# EasyEDA Pro project ProProject_485接口闭环步进电机控制器_V11_2025-04-04.epro, schematic Schematic1
Create Date: 2025-03-06; Page Name: P1; Project Name: 485接口闭环步进电机控制器_V11; Schematic Name: Schematic1; Update Date: 2025-03-23; Company: 嘉立创EDA; Page Size: A3; Version: V1.0
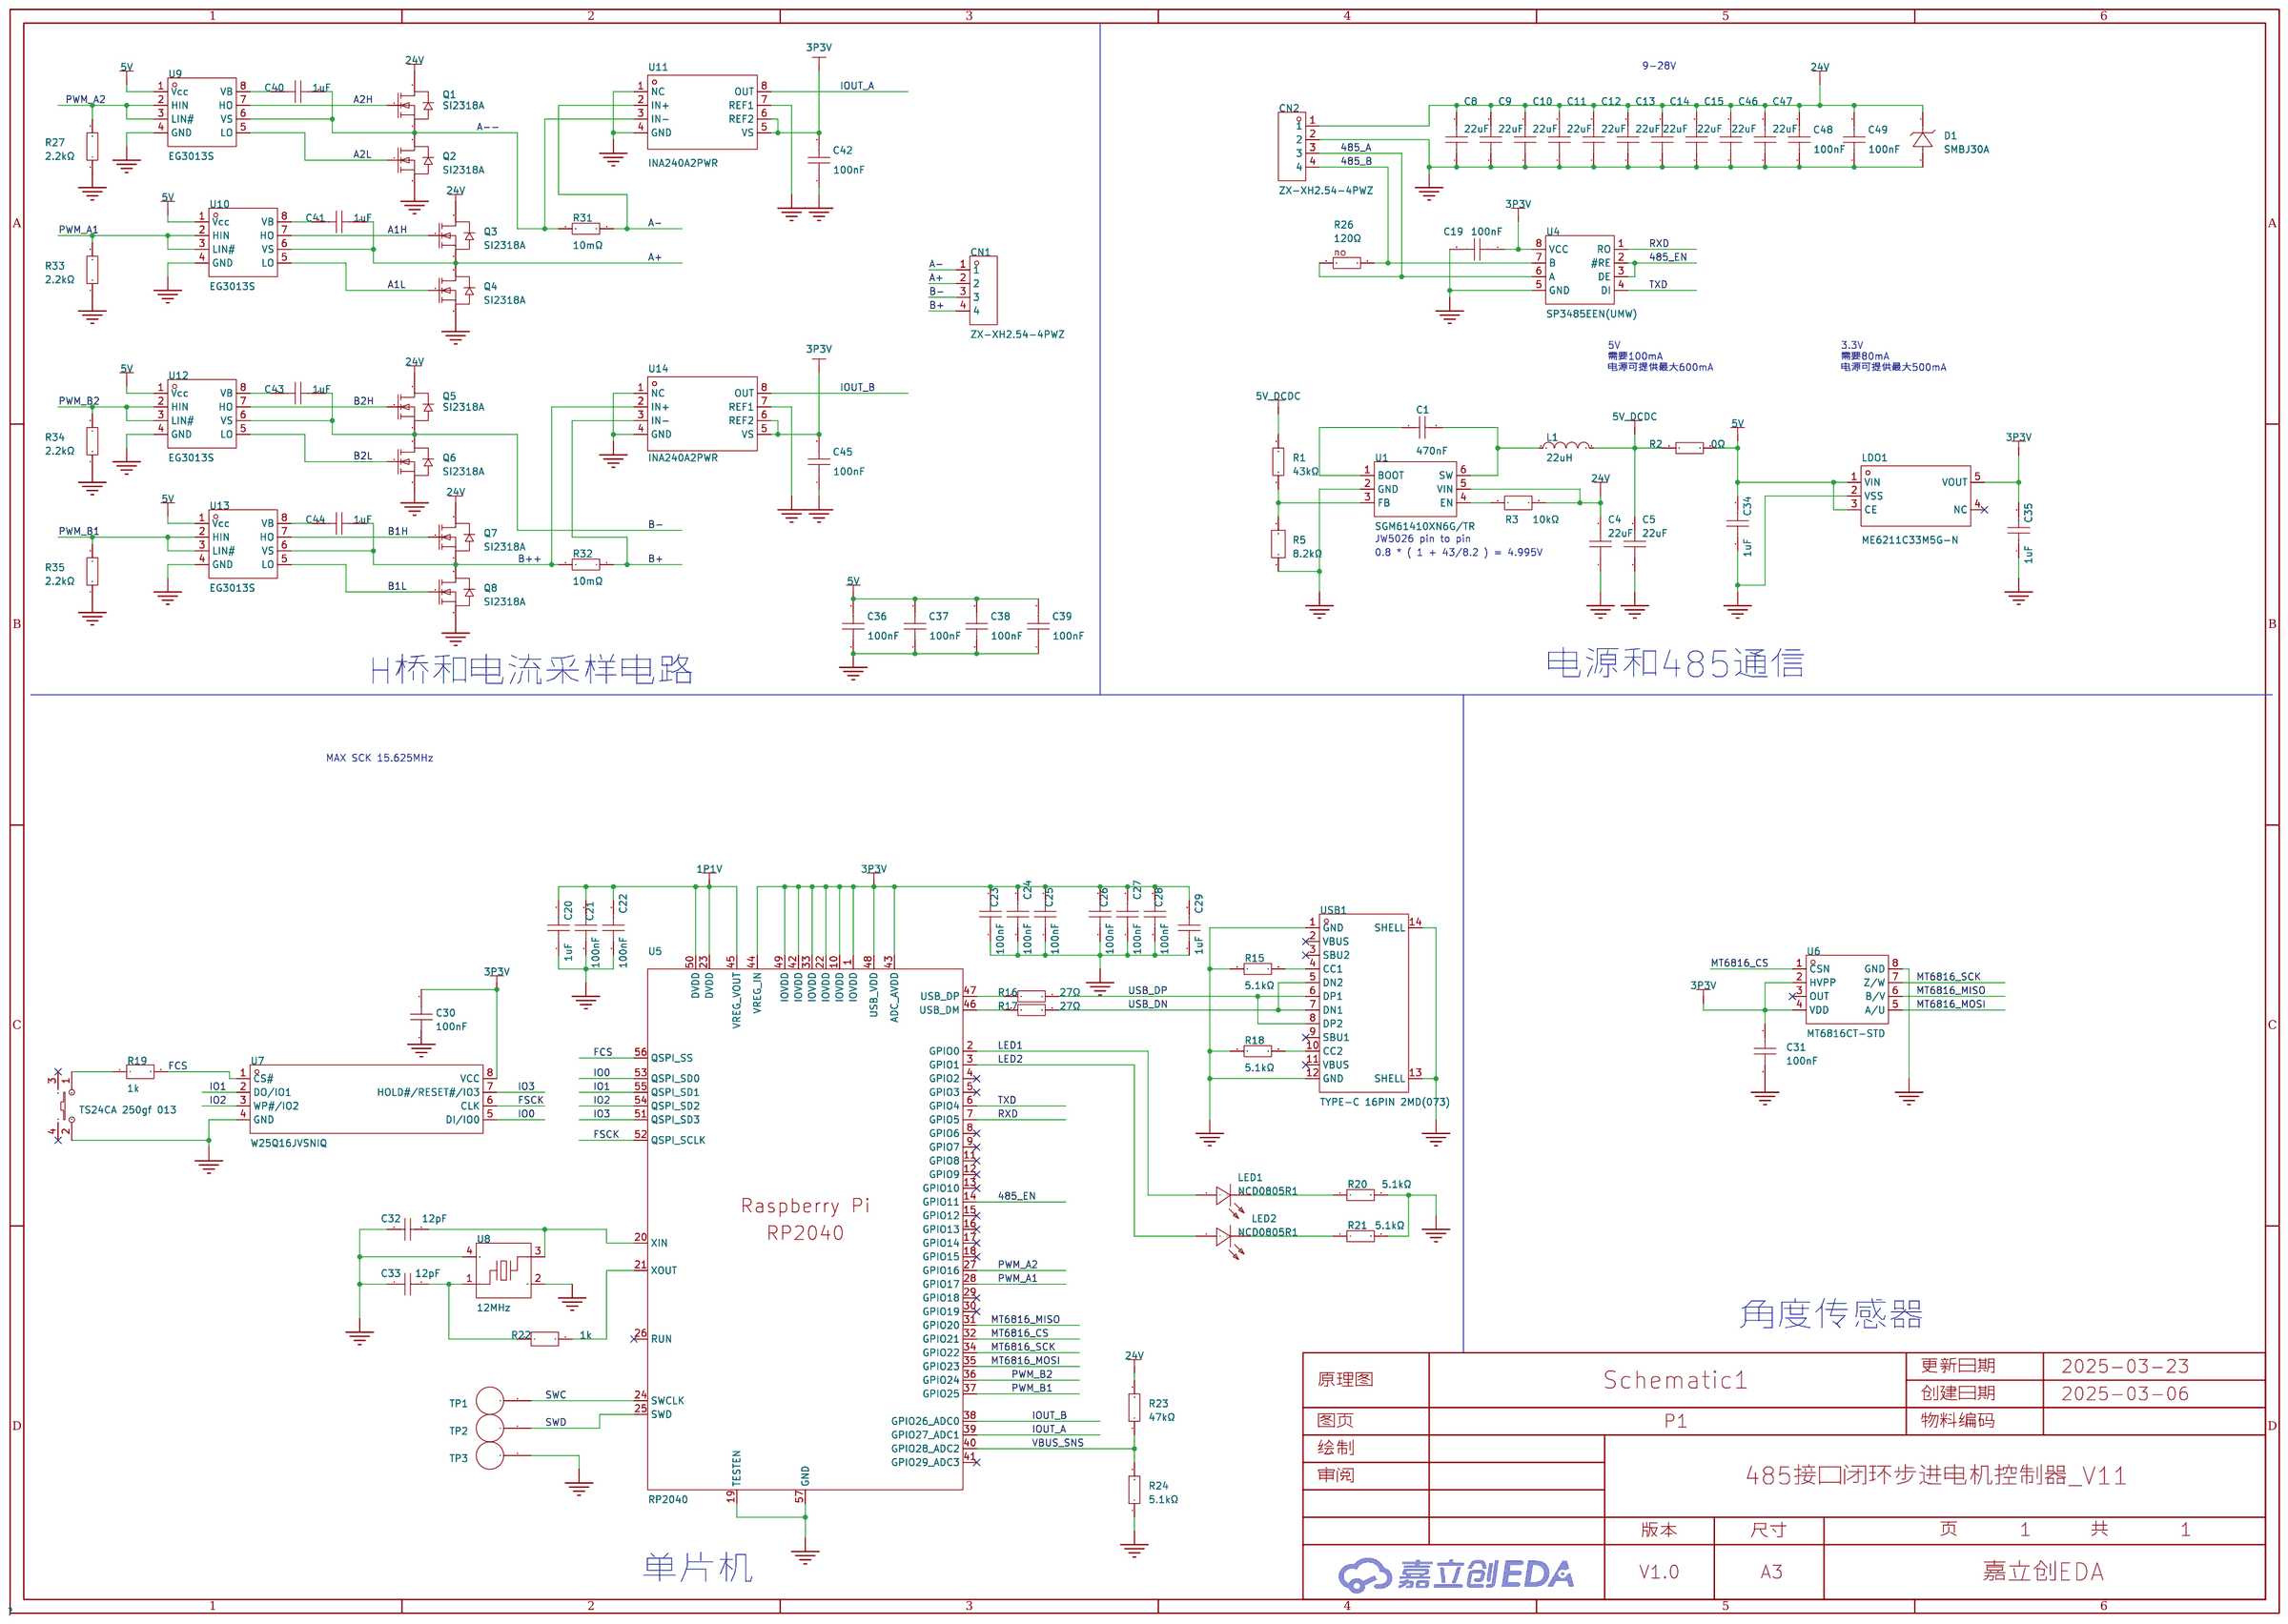
[diagram p0: schematic sheet]

## Parts
C1  470nF  [C0603]
C4  22uF  [C0805]
C5  22uF  [C0805]
C8  22uF  [C0805]
C9  22uF  [C0805]
C10  22uF  [C0805]
C11  22uF  [C0805]
C12  22uF  [C0805]
C13  22uF  [C0805]
C14  22uF  [C0805]
C15  22uF  [C0805]
C19  100nF  [C0603]
C20  1uF  [C0603]
C21  100nF  [C0603]
C22  100nF  [C0603]
C23  100nF  [C0603]
C24  100nF  [C0603]
C25  100nF  [C0603]
C26  100nF  [C0603]
C27  100nF  [C0603]
C28  100nF  [C0603]
C29  1uF  [C0603]
C30  100nF  [C0603]
C31  100nF  [C0603]
C32  12pF  [C0603]
C33  12pF  [C0603]
C34  1uF  [C0603]
C35  1uF  [C0603]
C36  100nF  [C0603]
C37  100nF  [C0603]
C38  100nF  [C0603]
C39  100nF  [C0603]
C40  1uF  [C0603]
C41  1uF  [C0603]
C42  100nF  [C0603]
C43  1uF  [C0603]
C44  1uF  [C0603]
C45  100nF  [C0603]
C46  22uF  [C0805]
C47  22uF  [C0805]
C48  100nF  [C0603]
C49  100nF  [C0603]
CN1  ZX-XH2.54-4PWZ  [CONN-TH_4P-P2.50_ZX-XH2.54-4PWZ]
CN2  ZX-XH2.54-4PWZ  [CONN-TH_4P-P2.50_ZX-XH2.54-4PWZ]
D1  SMBJ30A  [SMB_L4.6-W3.6-LS5.4-RD]
L1  22uH  [IND-SMD_L4.0-W4.0]
LDO1  ME6211C33M5G-N  [SOT-23-5_L3.0-W1.7-P0.95-LS2.8-BL]
LED1  NCD0805R1  [LED0805-R-RD]
LED2  NCD0805R1  [LED0805-R-RD]
Q1  SI2318A  [SOT-23-3_L2.9-W1.3-P1.90-LS2.4-BR]
Q2  SI2318A  [SOT-23-3_L2.9-W1.3-P1.90-LS2.4-BR]
Q3  SI2318A  [SOT-23-3_L2.9-W1.3-P1.90-LS2.4-BR]
Q4  SI2318A  [SOT-23-3_L2.9-W1.3-P1.90-LS2.4-BR]
Q5  SI2318A  [SOT-23-3_L2.9-W1.3-P1.90-LS2.4-BR]
Q6  SI2318A  [SOT-23-3_L2.9-W1.3-P1.90-LS2.4-BR]
Q7  SI2318A  [SOT-23-3_L2.9-W1.3-P1.90-LS2.4-BR]
Q8  SI2318A  [SOT-23-3_L2.9-W1.3-P1.90-LS2.4-BR]
R1  43kΩ  [R0603]
R2  0Ω  [R0603]
R3  10kΩ  [R0603]
R5  8.2kΩ  [R0603]
R15  5.1kΩ  [R0603]
R16  27Ω  [R0603]
R17  27Ω  [R0603]
R18  5.1kΩ  [R0603]
R19  1k  [R0603]
R20  5.1kΩ  [R0603]
R21  5.1kΩ  [R0603]
R22  1k  [R0603]
R23  47kΩ  [R0603]
R24  5.1kΩ  [R0603]
R26  120Ω  [R0603]  (no BOM)
R27  2.2kΩ  [R0603]
R31  10mΩ  [R0805]
R32  10mΩ  [R0805]
R33  2.2kΩ  [R0603]
R34  2.2kΩ  [R0603]
R35  2.2kΩ  [R0603]
SW1  TS24CA 250gf 013  [SW-SMD_L4.7-W3.5-P3.35-EH]
TP1  -  [TP]  (no BOM)
TP2  -  [TP]  (no BOM)
TP3  -  [TP]  (no BOM)
U1  SGM61410XN6G/TR  [TSOT-23-6_L2.9-W1.6-P0.95-LS2.8-BL]
U4  SP3485EEN(UMW)  [SOP-8_L5.0-W4.0-P1.27-LS6.0-BL]
U5  RP2040  [LQFN-56_L7.0-W7.0-P0.4-EP]
U6  MT6816CT-STD  [SOP-8_L4.9-W3.9-P1.27-LS6.0-BL]
U7  W25Q16JVSNIQ  [SOP-8_L4.9-W3.9-P1.27-LS6.0-BL]
U8  12MHz  [CRYSTAL-SMD_4P-L3.2-W2.5-BL_SIT8008BI]
U9  EG3013S  [SOP-8_L4.9-W3.9-P1.27-LS6.0-BL-1]
U10  EG3013S  [SOP-8_L4.9-W3.9-P1.27-LS6.0-BL-1]
U11  INA240A2PWR  [TSSOP-8_L4.4-W3.0-P0.65-LS6.4-BL]
U12  EG3013S  [SOP-8_L4.9-W3.9-P1.27-LS6.0-BL-1]
U13  EG3013S  [SOP-8_L4.9-W3.9-P1.27-LS6.0-BL-1]
U14  INA240A2PWR  [TSSOP-8_L4.4-W3.0-P0.65-LS6.4-BL]
USB1  TYPE-C 16PIN 2MD(073)  [USB-C-SMD_TYPE-C-6PIN-2MD-073]

## Library data of the parts
C1 = CL10B474KA8NNNC: 容值:470nF;精度:±10%;额定电压:25V;材质(温度系数):X7R;; LCSC Part Name: 470nF ±10% 25V; Supplier Part: C1623; Manufacturer: SAMSUNG(三星); Supplier Footprint: 0603; JLCPCB Part Class: 基础库; Datasheet: https://atta.szlcsc.com/upload/public/pdf/source/20160218/1457707763339.pdf; Supplier: LCSC; Tolerance: ±10%; Voltage Rated: 25V; Temperature Coefficient: X7R
C4 C5 C8-C15 C46 C47 = CGA0805X5R226M350MT: 容值:22uF;精度:±20%;额定电压:35V;材质(温度系数):X5R;; LCSC Part Name: 22uF ±20% 35V; Supplier Part: C6119901; Manufacturer: HRE(芯声); Supplier Footprint: 0805; JLCPCB Part Class: 扩展库; Datasheet: https://atta.szlcsc.com/upload/public/pdf/source/20231129/D589D0CC4D260F7AC3A77E53B455CCB3.pdf; Supplier: LCSC; Tolerance: ±20%; Voltage Rated: 35V; Temperature Coefficient: X5R
C19 C21-C28 C30 C31 C36-C39 C42 C45 C48 C49 = CC0603KRX7R9BB104: 容值:100nF;精度:±10%;额定电压:50V;材质(温度系数):X7R;; LCSC Part Name: 100nF ±10% 50V; Supplier Part: C14663; Manufacturer: YAGEO(国巨); Supplier Footprint: 0603; Datasheet: https://atta.szlcsc.com/upload/public/pdf/source/20180910/C282072_33301C7F631E79921B82A8DAC6BCC5B3.pdf; Supplier: LCSC; Tolerance: ±10%; Voltage Rated: 50V; Temperature Coefficient: X7R
C20 C29 C34 C35 C40 C41 C43 C44 = CL10A105KB8NNNC: 容值:1uF;精度:±10%;额定电压:50V;材质(温度系数):X5R;; LCSC Part Name: 1uF ±10% 50V; Supplier Part: C15849; Manufacturer: SAMSUNG(三星); Supplier Footprint: 0603; Datasheet: https://atta.szlcsc.com/upload/public/pdf/source/20160218/1457707763339.pdf; Supplier: LCSC; Tolerance: ±10%; Voltage Rated: 50V; Temperature Coefficient: X5R
C32 C33 = CL10C120JB8NNNC: 容值:12pF;精度:±5%;额定电压:50V;材质(温度系数):C0G;; LCSC Part Name: 12pF ±5% 50V; Supplier Part: C38523; Manufacturer: SAMSUNG(三星); Supplier Footprint: 0603; JLCPCB Part Class: 基础库; Datasheet: https://atta.szlcsc.com/upload/public/pdf/source/20160218/1457707763339.pdf; Supplier: LCSC; Tolerance: ±5%; Voltage Rated: 50V; Temperature Coefficient: C0G
CN1 CN2 = ZX-XH2.54-4PWZ: 插针结构:1x4P;间距:2.5mm;安装方式:弯插;参考系列:XH;总PIN数:4P;排数:1;每排PIN数:4;行距:-;额定电流:3A;触头材质:黄铜;触头镀层:锡;工作温度范围:-25℃~+85℃;; LCSC Part Name: 1x4P 间距:2.5mm 弯插 系列:XH; Supplier Part: C7429643; Manufacturer: Megastar(兆星); Supplier Footprint: 弯插,P=2.5mm; JLCPCB Part Class: 扩展库; Datasheet: https://atta.szlcsc.com/upload/public/pdf/source/20230619/8DC602C7BA46C153FF1BE89D90453879.pdf; Supplier: LCSC; Pins Structure: 1x4P; Pitch: 2.5mm; Mounting Type: 弯插; Reference Series: XH; Number of Pins: 4P; Number of Rows: 1; Number of PINs Per Row: 4; Rated Current: 3A; Contact Material: 黄铜; Contact Plating: 锡; Operating Temperature: -25℃~+85℃; Rated Voltage (Max): 250V; Plastic Material: PA66; Flame Retardant Rating: UL94V-0; Color: 白色; Z-Height of the Board: 5.9mm; X-Length of Bottom Edge on Board (Spacing Line): 12.5mm; Y-Width of Bottom Edge on Board: 7.32mm
D1 = SMBJ30A_C19077584: 极性:单向;反向截止电压(Vrwm):30V;钳位电压:48.4V;峰值脉冲电流(Ipp):12.4A;峰值脉冲功率(Ppp):600W;击穿电压:33.3V;; Supplier Part: C19077584; Manufacturer: 宏嘉诚; Supplier Footprint: SMB; JLCPCB Part Class: Extended Part; Datasheet: https://atta.szlcsc.com/upload/public/pdf/source/20250107/474F05451FC8AB27D7FA0238914F96F6.pdf; Supplier: LCSC; Polarity: 单向; Reverse Stand-Off Voltage (Vrwm): 30V; Clamping Voltage: 48.4V; Peak Pulse Current (Ipp): 12.4A; Peak Pulse Power Dissipation (Ppp): 600W; Voltage - Breakdown: 33.3V; Reverse Leakage Current (Ir): 5uA; Number of Channels: 单路; Type: TVS
L1 = FHD4020S-220MT: 电感值:22uH;精度:±20%;额定电流:1.1A;饱和电流(Isat):1.5A;; LCSC Part Name: 22uH ±20% 1.5A; Supplier Part: C843299; Manufacturer: cjiang(长江微电); Supplier Footprint: SMD,4x4mm; JLCPCB Part Class: 扩展库; Datasheet: https://atta.szlcsc.com/upload/public/pdf/source/20200609/C601990_BCEA243EC4DA0A9A288AA78A6DFB48A5.pdf; Supplier: LCSC; Tolerance: ±20%; Rated Current: 1.1A; Saturation Current (Isat): 1.5A; DC Resistance (DCR): 415mΩ
LDO1 = ME6211C33M5G-N: 输出类型:固定;最大输入电压:6V;输出电压:3.3V;最大输出电流:500mA;电源纹波抑制比(PSRR):70dB;输出极性:正极;; LCSC Part Name: 输入6V 输出3.3V 500mA; Supplier Part: C82942; Manufacturer: MICRONE(南京微盟); Supplier Footprint: SOT-23-5; JLCPCB Part Class: 扩展库; Datasheet: https://atta.szlcsc.com/upload/public/pdf/source/20170918/C82942_1505727073070976520.pdf; Supplier: LCSC; Output Type: 固定; Maximum Input Voltage: 6V; Output Voltage: 3.3V; MAX Output Current: 500mA; Power Supply Rejection Ratio (PSRR): 70dB; Dropout Voltage: 260mV@(200mA); Output Polarity: 正极; Number of Outputs: 1
LED1 LED2 = NCD0805R1: 灯头类型:-;发光颜色:红色;正向电压(VF):1.6V~2.6V;功率:65mW;正向电流:20mA;主波长:615nm~630nm;二极管配置:独立二极管;透镜颜色:无色透明透镜;色温:-;发光强度:67mcd~195mcd;发光角度:130°;载带方式:-;工作温度:-30℃~+85℃;; Supplier Part: C84256; Manufacturer: 国星光电; Supplier Footprint: 0805; JLCPCB Part Class: 基础库; Datasheet: https://atta.szlcsc.com/upload/public/pdf/source/20200820/C84256_F0A75A43B3EAD75808600A0514C76B99.pdf; Supplier: LCSC; Emitted Color: 红色; Forward Voltage (VF): 1.6V~2.6V; Power Dissipation: 65mW; Forward Current: 20mA; Dominant Wavelength: 615nm~630nm; Diode Configuration: 独立二极管; Lens Color: 无色透明透镜; Luminous Intensity: 67mcd~195mcd; Viewing Angle: 130°; Operating Temperature: -30℃~+85℃
Q1-Q8 = SI2318A: 类型:1个N沟道;漏源电压(Vdss):40V;连续漏极电流(Id):5.6A;导通电阻(RDS(on)@Vgs,Id):46mΩ@4.5V,3.9A;功率(Pd):1.25W;阈值电压(Vgs(th)@Id):1.2V@250uA;; LCSC Part Name: 1个N沟道 耐压:40V 电流:5.6A; Supplier Part: C2681218; Manufacturer: UMW(友台半导体); Supplier Footprint: SOT-23; JLCPCB Part Class: Extended Part; Datasheet: https://atta.szlcsc.com/upload/public/pdf/source/20231109/51CF644F539AF1C6DDE945D9CE214444.pdf; Supplier: LCSC; Type: 1个N沟道; Drain Source Voltage (Vdss): 40V; Continuous Drain Current (Id): 5.6A; Drain Source On Resistance (RDS(on)@Vgs,Id): 46mΩ@4.5V,3.9A; Power Dissipation (Pd): 1.25W; Gate Threshold Voltage (Vgs(th)@Id): 1.2V@250uA; Total Gate Charge (Qg@Vgs): 5.8nC@20V; Input Capacitance (Ciss@Vds): 340pF; Reverse Transfer Capacitance (Crss@Vds): 30pF; Operating Temperature: -55℃~+150℃
R1 = 0603WAF4302T5E: 电阻类型:厚膜电阻;阻值:43kΩ;精度:±1%;功率:100mW;最大工作电压:75V;温度系数:±100ppm/℃;; LCSC Part Name: 43kΩ ±1% 100mW 厚膜电阻; Supplier Part: C23172; Manufacturer: UNI-ROYAL(厚声); Supplier Footprint: 0603; JLCPCB Part Class: Extended Part; Datasheet: https://atta.szlcsc.com/upload/public/pdf/source/20200306/C422600_1E6D84923E4A46A82E41ADD87F860B5C.pdf; Supplier: LCSC; Type: 厚膜电阻; Tolerance: ±1%; Power(Watts): 100mW; Overload Voltage (Max): 75V; Temperature Coefficient: ±100ppm/℃; Operating Temperature Range: -55℃~+155℃
R2 = 0603WAF0000T5E: 电阻类型:厚膜电阻;阻值:0Ω;精度:±1%;功率:100mW;最大工作电压:75V;; LCSC Part Name: 0Ω ±1% 100mW 厚膜电阻; Supplier Part: C21189; Manufacturer: UNI-ROYAL(厚声); Supplier Footprint: 0603; JLCPCB Part Class: 基础库; Datasheet: https://atta.szlcsc.com/upload/public/pdf/source/20200306/C422600_1E6D84923E4A46A82E41ADD87F860B5C.pdf; Supplier: LCSC; Type: 厚膜电阻; Tolerance: ±1%; Power(Watts): 100mW; Overload Voltage (Max): 75V; Operating Temperature Range: -55℃~+155℃
R3 = AT0603BRD0710KL: 电阻类型:薄膜电阻;阻值:10kΩ;精度:±0.1%;功率:100mW;; LCSC Part Name: 10kΩ ±0.1% 100mW; Supplier Part: C723396; Manufacturer: YAGEO(国巨); Supplier Footprint: 0603; JLCPCB Part Class: 扩展库; Datasheet: https://atta.szlcsc.com/upload/public/pdf/source/20200722/C705051_EA338A836C78FCD1C867566BE6F43B3A.pdf; Supplier: LCSC; Type: 薄膜电阻; Tolerance: ±0.1%; Power(Watts): 100mW; Temperature Coefficient: ±25ppm/℃; Overload Voltage (Max): 75V; Operating Temperature Range: -55℃~+155℃
R5 = FRC0603F8201TS: 电阻类型:厚膜电阻;阻值:8.2kΩ;精度:±1%;功率:100mW;工作电压:75V;温度系数:±100ppm/℃;; LCSC Part Name: 8.2kΩ ±1% 100mW 厚膜电阻; Supplier Part: C2907069; Manufacturer: FOJAN(富捷); Supplier Footprint: 0603; JLCPCB Part Class: Extended Part; Datasheet: https://atta.szlcsc.com/upload/public/pdf/source/20211221/925EC7D7225764EE0046F22065062C87.pdf; Supplier: LCSC; Type: 厚膜电阻; Tolerance: ±1%; Power(Watts): 100mW; Voltage-Supply(Max): 75V; Temperature Coefficient: ±100ppm/℃; Operating Temperature: -55℃~+155℃; Overload Voltage (Max): 75V; Operating Temperature Range: -55℃~+155℃
R15 R18 R20 R21 R24 = 0603WAF5101T5E: 阻值:5.1kΩ;精度:±1%;功率:100mW;温度系数:±100ppm/℃;电阻类型:厚膜电阻;; LCSC Part Name: 5.1kΩ ±1% 100mW 厚膜电阻; Supplier Part: C23186; Manufacturer: UNI-ROYAL(厚声); Supplier Footprint: 0603; Datasheet: https://atta.szlcsc.com/upload/public/pdf/source/20200306/C422600_1E6D84923E4A46A82E41ADD87F860B5C.pdf; Supplier: LCSC; Tolerance: ±1%; Power(Watts): 100mW; Overload Voltage (Max): 75V; Temperature Coefficient: ±100ppm/℃; Type: 厚膜电阻; Operating Temperature Range: -55℃~+155℃
R16 R17 = RS-03K27R0FT: 精度:±1%;温度系数:±100ppm/℃;阻值:27Ω;功率:100mW;最大工作电压:50V;工作温度范围:-55℃~+155℃;; LCSC Part Name: 27.0Ω(27R0) ±1%; Supplier Part: C321830; Manufacturer: FH(风华); Supplier Footprint: 0603; JLCPCB Part Class: 扩展库; Datasheet: https://atta.szlcsc.com/upload/public/pdf/source/20181120/C321830_E77A57045CE9A79D257E73FE3C106617.pdf; Supplier: LCSC; Tolerance: ±1%; Temperature Coefficient: ±100ppm/℃; Power(Watts): 100mW; Overload Voltage (Max): 50V; Operating Temperature Range: -55℃~+155℃
R19 R22 = 1k: Supplier Part: C9900012840; JLCPCB Part Class: 扩展库; Supplier: LCSC
R23 = 0603WAF4702T5E: 电阻类型:厚膜电阻;阻值:47kΩ;精度:±1%;功率:100mW;最大工作电压:75V;温度系数:±100ppm/℃;; LCSC Part Name: 47kΩ ±1% 100mW 厚膜电阻; Supplier Part: C25819; Manufacturer: UNI-ROYAL(厚声); Supplier Footprint: 0603; JLCPCB Part Class: 基础库; Datasheet: https://atta.szlcsc.com/upload/public/pdf/source/20200306/C422600_1E6D84923E4A46A82E41ADD87F860B5C.pdf; Supplier: LCSC; Type: 厚膜电阻; Tolerance: ±1%; Power(Watts): 100mW; Overload Voltage (Max): 75V; Temperature Coefficient: ±100ppm/℃; Operating Temperature Range: -55℃~+155℃
R26 = 0603WAF1200T5E: 电阻类型:厚膜电阻;阻值:120Ω;精度:±1%;功率:100mW;最大工作电压:75V;温度系数:±100ppm/℃;; LCSC Part Name: 120Ω ±1% 100mW 厚膜电阻; Supplier Part: C22787; Manufacturer: UNI-ROYAL(厚声); Supplier Footprint: 0603; JLCPCB Part Class: 基础库; Datasheet: https://atta.szlcsc.com/upload/public/pdf/source/20200306/C422600_1E6D84923E4A46A82E41ADD87F860B5C.pdf; Supplier: LCSC; Type: 厚膜电阻; Tolerance: ±1%; Power(Watts): 100mW; Overload Voltage (Max): 75V; Temperature Coefficient: ±100ppm/℃; Operating Temperature Range: -55℃~+155℃
R27 R33-R35 = 0603WAF2201T5E: 电阻类型:厚膜电阻;阻值:2.2kΩ;精度:±1%;功率:100mW;最大工作电压:75V;温度系数:±100ppm/℃;; LCSC Part Name: 2.2kΩ ±1% 100mW 厚膜电阻; Supplier Part: C4190; Manufacturer: UNI-ROYAL(厚声); Supplier Footprint: 0603; JLCPCB Part Class: Basic Part; Datasheet: https://atta.szlcsc.com/upload/public/pdf/source/20200306/C422600_1E6D84923E4A46A82E41ADD87F860B5C.pdf; Supplier: LCSC; Type: 厚膜电阻; Tolerance: ±1%; Power(Watts): 100mW; Overload Voltage (Max): 75V; Temperature Coefficient: ±100ppm/℃; Operating Temperature Range: -55℃~+155℃
R31 R32 = 0805W4F100MT5E: 电阻类型:厚膜电阻;阻值:10mΩ;精度:±1%;功率:250mW;最大工作电压:150V;; LCSC Part Name: 10mΩ ±1% 250mW 厚膜电阻; Supplier Part: C270927; Manufacturer: UNI-ROYAL(厚声); Supplier Footprint: 0805; JLCPCB Part Class: Extended Part; Datasheet: https://atta.szlcsc.com/upload/public/pdf/source/20191226/C423819_BA9DD8C30400529167FBE977063CB830.pdf; Supplier: LCSC; Type: 厚膜电阻; Tolerance: ±1%; Power(Watts): 250mW; Overload Voltage (Max): 150V; Operating Temperature Range: -55℃~+155℃
SW1 = TS24CA 250gf 013: 电路结构:单刀单掷;按钮形状:矩形按钮;作用力:250gf;安装方式:卧贴;开关长度:4.55mm;开关宽度:1.8mm;开关高度:3.5mm;带支架:不带;触点电流:50mA;额定电压(AC):-;额定电压(DC):12V;额定功率:0.6W;绝缘电阻:100MΩ;带灯:无;机械寿命:3万次;; LCSC Part Name: 2*4*3.5mm半包小贝贝TS-018小侧按键m165蓝牙耳机开关 250gf; Supplier Part: C5373430; Manufacturer: SHOU HAN(首韩); Supplier Footprint: SMD; JLCPCB Part Class: 扩展库; Datasheet: https://atta.szlcsc.com/upload/public/pdf/source/20230321/913029B0FB0CD391AF5EFD51697D8EC4.pdf; Supplier: LCSC; Circuit: 单刀单掷; Actuator Style: 矩形按钮; Operating Force: 250gf; Mounting Style: 卧贴; Switch Length: 4.55mm; Switch Width: 1.8mm; Switch Height: 3.5mm; Strike Gundam: 不带; Contact Current: 50mA; Voltage Rating (DC): 12V; Power Rating: 0.6W; Insulation Resistance: 100MΩ; Actuator/Cap Color: 黑色; With Lamp: 无; Mechanical Life: 3万次; Operating Temperature: -40℃~+85℃
TP1-TP3 = TP: Check: true
U1 = SGM61410XN6G/TR: Supplier Part: C699689; Manufacturer: SGMICRO(圣邦微); Supplier Footprint: SOT-23-6; JLCPCB Part Class: 扩展库; Datasheet: https://atta.szlcsc.com/upload/public/pdf/source/20221031/3A734AD801C2757449C6479E72FDC49F.pdf; Supplier: LCSC
U4 = SP3485EEN(UMW): 类型:收发器;数据速率:12Mbps;; LCSC Part Name: SP3485E 3.3V电源，最多256个节点，12Mbps半双工，RS485/RS422收发器; Supplier Part: C668205; Manufacturer: UMW(友台半导体); Supplier Footprint: SOP-8; JLCPCB Part Class: 扩展库; Datasheet: https://atta.szlcsc.com/upload/public/pdf/source/20240223/FED69C9FF7082854C69A701499F648A3.pdf; Supplier: LCSC; Types: 收发器; Number of Driver: 1; Number of receiver: 1; Supply Voltage: 2.97V~3.63V; Data Rate: 12Mbps; Operating Temperature: -40℃~+85℃
U5 = RP2040_C2040: CPU内核:ARM-M系列;CPU最大主频:133MHz;程序存储容量:-;程序存储器类型:-;GPIO端口数量:30;工作电压范围:-;RAM总容量:264KB;应用领域:-;; Supplier Part: C2040; Manufacturer: Raspberry Pi(树莓派); Supplier Footprint: LQFN-56(7x7); Datasheet: https://atta.szlcsc.com/upload/public/pdf/source/20210621/C2040_96F425825606B7957D87DD32E2512CA9.pdf; Supplier: LCSC; CPU Core: ARM-M系列; CPU Maximum Speed: 133MHz; GPIO Ports Number: 30; RAM Size: 264KB; ADC (Bit): 12bit; UART/USART: 2; I2C: 2; SPI: 2; Universal Serial Bus: 有; Peripheral/Function: DMA；PWM; Direct Memory Access: 有
U6 = MT6816CT-STD: 零延迟磁角位置传感器IC; LCSC Part Name: 磁位置传感器; Supplier Part: C2925077; Manufacturer: MagnTek(麦歌恩); Supplier Footprint: SOP-8; JLCPCB Part Class: 扩展库; Datasheet: https://atta.szlcsc.com/upload/public/pdf/source/20211202/34073ED58EE6E476BE477C7F05608C83.pdf; Supplier: LCSC
U7 = W25Q16JVSNIQ_C2456211: Supplier Part: C2456211; Manufacturer: WINBOND(华邦); Supplier Footprint: SOP-8; JLCPCB Part Class: 扩展库; Datasheet: https://atta.szlcsc.com/upload/public/pdf/source/20190529/C115407_78E5B4F96E7138D299EC51EC5982A1A5.pdf; Supplier: LCSC
U8 = CF4012M00012001: 晶振类型:贴片晶振;频率:12MHz;常温频差:±10ppm;外接负载电容:12pF;频率稳定度(全温):±30ppm;; LCSC Part Name: 12MHz ±10ppm 12pF; Supplier Part: C7294550; Manufacturer: HUAXIN(华昕); Supplier Footprint: SMD-3225-4P; Datasheet: https://atta.szlcsc.com/upload/public/pdf/source/20230614/3722586679DD390FF3DAA05DC65F5BC0.pdf; Supplier: LCSC; Crystal Type: 贴片晶振; Normal temperature Frequency Tolerance: ±10ppm; External load capacitor: 12pF; Frequency Stability(Full temperature range): ±30ppm; Equivalent Series Resistance (ESR): 40Ω; Operating Temperature: -40℃~+85℃
U9 U10 U12 U13 = EG3013S: Supplier Part: C5138297; Manufacturer: EG(屹晶微); Supplier Footprint: SOP-8; JLCPCB Part Class: Extended Part; Datasheet: https://atta.szlcsc.com/upload/public/pdf/source/20240401/B57332368F1567A90B75A8EC20454C1B.pdf; Supplier: LCSC
U11 U14 = INA240A2PWR: 放大器数:单路;; Supplier Part: C129949; Manufacturer: TI(德州仪器); Supplier Footprint: TSSOP-8; JLCPCB Part Class: Extended Part; Datasheet: https://www.ti.com/cn/lit/gpn/ina240; Supplier: LCSC; Number of Channels: 单路; Supply Current: 1.8mA; Operating Temperature: -40℃~+125℃
USB1 = TYPE-C 16PIN 2MD(073): 连接器类型:Type-C;标准:-;公母:母;触点数量:16P;端口数量:1;安装方式:卧贴;额定电流 - 电源:5A;工作温度范围:-25℃~+85℃;; LCSC Part Name: Type-C 母 卧贴 带定位柱 不锈钢外壳 2次模顶; Supplier Part: C2765186; Manufacturer: SHOU HAN(首韩); Supplier Footprint: SMD; JLCPCB Part Class: 扩展库; Datasheet: https://atta.szlcsc.com/upload/public/pdf/source/20211123/39B17C16241EAC15C5E277BDA434118E.pdf; Supplier: LCSC; Connector Type: Type-C; Gender: 母; Number of Contacts: 16P; Number of Ports: 1; Mounting Style: 卧贴; Current Rating - Power (Max): 5A; Operating Temperature Range: -25℃~+85℃

## Nets
5V: C34.2 C36.2 C37.2 C38.2 C39.2 LDO1.1(VIN) LDO1.3(CE) R2.2 U9.1(Vcc) U10.1(Vcc) U12.1(Vcc) U13.1(Vcc)
5V_DCDC: C5.2 L1.2 R1.2 R2.1
24V: C4.2 C8.2 C9.2 C10.2 C11.2 C12.2 C13.2 C14.2 C15.2 C46.2 C47.2 C48.2 C49.2 CN2.1 D1.1(K) Q1.3(D) Q3.3(D) Q5.3(D) Q7.3(D) R3.2 R23.2 U1.5(VIN)
GND: C4.1 C5.1 C8.1 C9.1 C10.1 C11.1 C12.1 C13.1 C14.1 C15.1 C19.2 C20.1 C21.1 C22.1 C23.1 C24.1 C25.1 C26.1 C27.1 C28.1 C29.1 C30.1 C31.2 C32.1 C33.1 C34.1 C35.1 C36.1 C37.1 C38.1 C39.1 C42.1 C45.1 C46.1 C47.1 C48.1 C49.1 CN2.2 D1.2(A) LDO1.2(VSS) Q2.2(S) Q4.2(S) Q6.2(S) Q8.2(S) R5.1 R15.1 R18.1 R20.2 R21.2 R24.1 R27.1 R33.1 R34.1 R35.1 SW1.2 TP3.1 U1.2(GND) U4.5(GND) U5.19(TESTEN) U5.57(GND) U6.8(GND) U7.4(GND) U8.2(GND) U8.4(GND) U9.4(GND) U10.4(GND) U11.1(NC) U11.4(GND) U11.7(REF1) U12.4(GND) U13.4(GND) U14.1(NC) U14.4(GND) U14.7(REF1) USB1.1(GND) USB1.12(GND) USB1.13(SHELL) USB1.14(SHELL)
VBUS_SNS: R23.1 R24.2 U5.40(GPIO28_ADC2)
1P1V: C20.2 C21.2 C22.2 U5.23(DVDD) U5.45(VREG_VOUT) U5.50(DVDD)
3P3V: C19.1 C23.2 C24.2 C25.2 C26.2 C27.2 C28.2 C29.2 C30.2 C31.1 C35.2 C42.2 C45.2 LDO1.5(VOUT) U4.8(VCC) U5.1(IOVDD) U5.10(IOVDD) U5.22(IOVDD) U5.33(IOVDD) U5.42(IOVDD) U5.43(ADC_AVDD) U5.44(VREG_IN) U5.48(USB_VDD) U5.49(IOVDD) U6.2(HVPP) U6.4(VDD) U7.8(VCC) U11.5(VS) U11.6(REF2) U14.5(VS) U14.6(REF2)
485_A: CN2.3 R26.1 U4.6(A)
485_B: CN2.4 R26.2 U4.7(B)
485_EN: U4.2(#RE) U4.3(DE) U5.14(GPIO11)
A1H: Q3.1(G) U10.7(HO)
A1L: Q4.1(G) U10.5(LO)
A2H: Q1.1(G) U9.7(HO)
A2L: Q2.1(G) U9.5(LO)
A+: C41.1 CN1.2 Q3.2(S) Q4.3(D) U10.6(VS)
A-: CN1.1 R31.2 U11.2(IN+)
A--: C40.1 Q1.2(S) Q2.3(D) R31.1 U9.6(VS) U11.3(IN-)
B1H: Q7.1(G) U13.7(HO)
B1L: Q8.1(G) U13.5(LO)
B2H: Q5.1(G) U12.7(HO)
B2L: Q6.1(G) U12.5(LO)
B+: CN1.4 R32.2 U14.3(IN-)
B++: C44.1 Q7.2(S) Q8.3(D) R32.1 U13.6(VS) U14.2(IN+)
B-: C43.1 CN1.3 Q5.2(S) Q6.3(D) U12.6(VS)
FCS: R19.2 U5.56(QSPI_SS) U7.1(CS#)
FSCK: U5.52(QSPI_SCLK) U7.6(CLK)
IO0: U5.53(QSPI_SD0) U7.5(DI/IO0)
IO1: U5.55(QSPI_SD1) U7.2(DO/IO1)
IO2: U5.54(QSPI_SD2) U7.3(WP#/IO2)
IO3: U5.51(QSPI_SD3) U7.7(HOLD#/RESET#/IO3)
IOUT_A: U5.39(GPIO27_ADC1) U11.8(OUT)
IOUT_B: U5.38(GPIO26_ADC0) U14.8(OUT)
LED1: LED1.1(+) U5.2(GPIO0)
LED2: LED2.1(+) U5.3(GPIO1)
MT6816_CS: U5.32(GPIO21) U6.1(CSN)
MT6816_MISO: U5.31(GPIO20) U6.6(B/V)
MT6816_MOSI: U5.35(GPIO23) U6.5(A/U)
MT6816_SCK: U5.34(GPIO22) U6.7(Z/W)
PWM_A1: R33.2 U5.28(GPIO17) U10.2(HIN) U10.3(LIN#)
PWM_A2: R27.2 U5.27(GPIO16) U9.2(HIN) U9.3(LIN#)
PWM_B1: R35.2 U5.37(GPIO25) U13.2(HIN) U13.3(LIN#)
PWM_B2: R34.2 U5.36(GPIO24) U12.2(HIN) U12.3(LIN#)
RXD: U4.1(RO) U5.7(GPIO5)
SWC: TP1.1 U5.24(SWCLK)
SWD: TP2.1 U5.25(SWD)
TXD: U4.4(DI) U5.6(GPIO4)
USB_DN: R17.2 USB1.5(DN2) USB1.7(DN1)
USB_DP: R16.2 USB1.6(DP1) USB1.8(DP2)
$1N1406: R18.2 USB1.10(CC2)
$1N1407: R15.2 USB1.4(CC1)
$1N1433: R19.1 SW1.1
$1N1437: R16.1 U5.47(USB_DP)
$1N1440: R17.1 U5.46(USB_DM)
$1N1441: R22.2 U5.21(XOUT)
$1N1445: C33.2 R22.1 U8.1
$1N1446: C32.2 U5.20(XIN) U8.3
$1N3757: R3.1 U1.4(EN)
$1N3760: C1.2 L1.1 U1.6(SW)
$1N3761: C1.1 U1.1(BOOT)
$1N3763: R1.1 R5.2 U1.3(FB)
$1N15393: LED1.2(-) R20.1
$1N15394: LED2.2(-) R21.1
$1N23169: C40.2 U9.8(VB)
$1N23635: C41.2 U10.8(VB)
$1N25067: C43.2 U12.8(VB)
$1N25091: C44.2 U13.8(VB)

Not connected (* = marked no-connect by the designer): LDO1 4(NC)*; SW1 3* 4*; U5 4(GPIO2)* 5(GPIO3)* 8(GPIO6)* 9(GPIO7)* 11(GPIO8)* 12(GPIO9)* 13(GPIO10)* 15(GPIO12)* 16(GPIO13)* 17(GPIO14)* 18(GPIO15)* 26(RUN)* 29(GPIO18)* 30(GPIO19)* 41(GPIO29_ADC3)*; U6 3(OUT)*; USB1 2(VBUS)* 3(SBU2)* 9(SBU1)* 11(VBUS)*

## Notes on the sheet
- 9-28V
- 5V
  需要100mA
  电源可提供最大600mA
- 3.3V
  需要80mA
  电源可提供最大500mA
- JW5026 pin to pin
- 0.8 * ( 1 + 43/8.2 ) = 4.995V
- 电源和485通信
- H桥和电流采样电路
- MAX SCK 15.625MHz
- 角度传感器
- 单片机
